# Altium schematic sheet TEENSY 4.SchDoc
size A; SheetNumber: 1; SheetTotal: 1
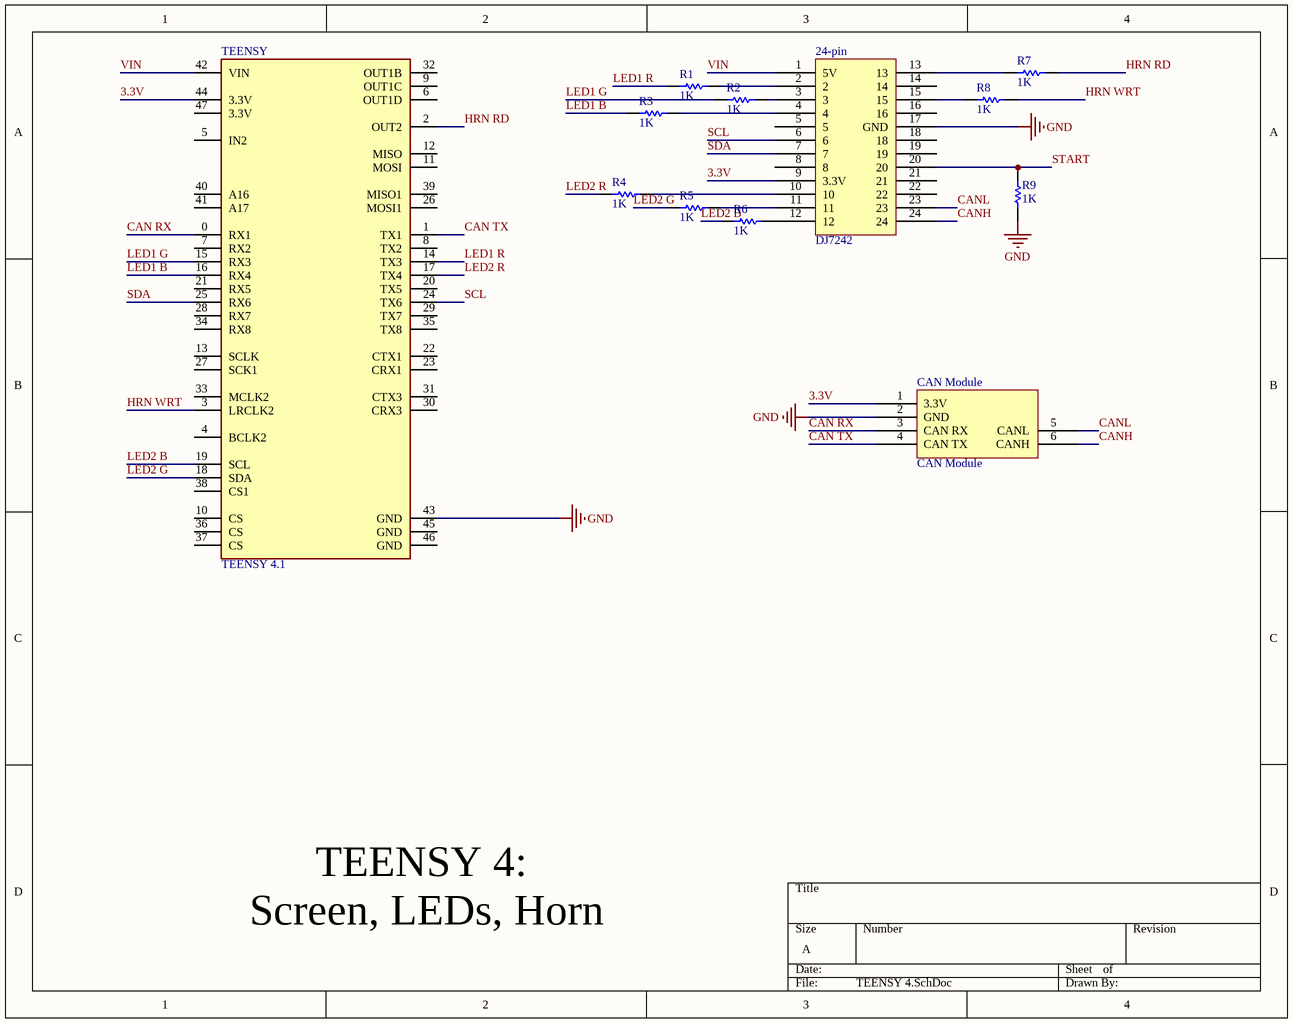
[diagram p0: TEENSY 4.SchDoc]

## Parts
24-pin  DJ7242  [DJ7242-Footprint-1]
CAN_Module  CAN Module  [CAN Module-Footprint-1]
R1  value 1K  (hidden comment: Resistor)
R2  value 1K  (hidden comment: Resistor)
R3  value 1K  (hidden comment: Resistor)
R4  value 1K  (hidden comment: Resistor)
R5  value 1K  (hidden comment: Resistor)
R6  value 1K  (hidden comment: Resistor)
R7  value 1K  (hidden comment: Resistor)
R8  value 1K  (hidden comment: Resistor)
R9  value 1K  (hidden comment: Resistor)
TEENSY  TEENSY 4.1  [FP-DEV-16996-MFG]

## Nets
GND: 24-pin.17(GND) CAN_Module.2(GND) R9.1 TEENSY.43(GND)
3.3V: 24-pin.9(3.3V) CAN_Module.1(3.3V) TEENSY.44(3.3V)
CAN RX: CAN_Module.3(CAN_RX) TEENSY.0(RX1)
CAN TX: CAN_Module.4(CAN_TX) TEENSY.1(TX1)
CANH: 24-pin.24 CAN_Module.6(CANH)
CANL: 24-pin.23 CAN_Module.5(CANL)
HRN RD: R7.2 TEENSY.2(OUT2)
HRN WRT: R8.2 TEENSY.3(LRCLK2)
LED1 B: R3.2 TEENSY.16(RX4)
LED1 G: R2.2 TEENSY.15(RX3)
LED1 R: R1.2 TEENSY.14(TX3)
LED2 B: R6.2 TEENSY.19(SCL)
LED2 G: R5.2 TEENSY.18(SDA)
LED2 R: R4.2 TEENSY.17(TX4)
SCL: 24-pin.6 TEENSY.24(TX6)
SDA: 24-pin.7 TEENSY.25(RX6)
START: 24-pin.20 R9.2
VIN: 24-pin.1(5V) TEENSY.42(VIN)
Net24-pin_2: 24-pin.2 R1.1
Net24-pin_3: 24-pin.3 R2.1
Net24-pin_4: 24-pin.4 R3.1
Net24-pin_10: 24-pin.10 R4.1
Net24-pin_11: 24-pin.11 R5.1
Net24-pin_12: 24-pin.12 R6.1
Net24-pin_13: 24-pin.13 R7.1
Net24-pin_15: 24-pin.15 R8.1

Not connected (* = marked no-connect by the designer): 24-pin 5 8 14 16 18 19 21 22; TEENSY 4(BCLK2) 5(IN2) 6(OUT1D) 7(RX2) 8(TX2) 9(OUT1C) 10(CS) 11(MOSI) 12(MISO) 13(SCLK) 20(TX5) 21(RX5) 22(CTX1) 23(CRX1) 26(MOSI1) 27(SCK1) 28(RX7) 29(TX7) 30(CRX3) 31(CTX3) 32(OUT1B) 33(MCLK2) 34(RX8) 35(TX8) 36(CS) 37(CS) 38(CS1) 39(MISO1) 40(A16) 41(A17) 45(GND) 46(GND) 47(3.3V)

## Notes on the sheet
- TEENSY 4:
  Screen, LEDs, Horn

## Library data of the parts
24-pin = CMP-00030-00002-4: 24-pin connector
CAN_Module = CMP-00030-00003-1: CAN waveshare
R1-R9 = Resistor: TC1: 0; SimulationGenericComponent: True; TC2: 0
TEENSY = CMP-157412-000001-1: TEENSY 4.1 (HEADERS)